# Altium schematic sheet Programming_and_Clock_FPGA.SchDoc
size A1; SheetNumber: 1; SheetTotal: 6
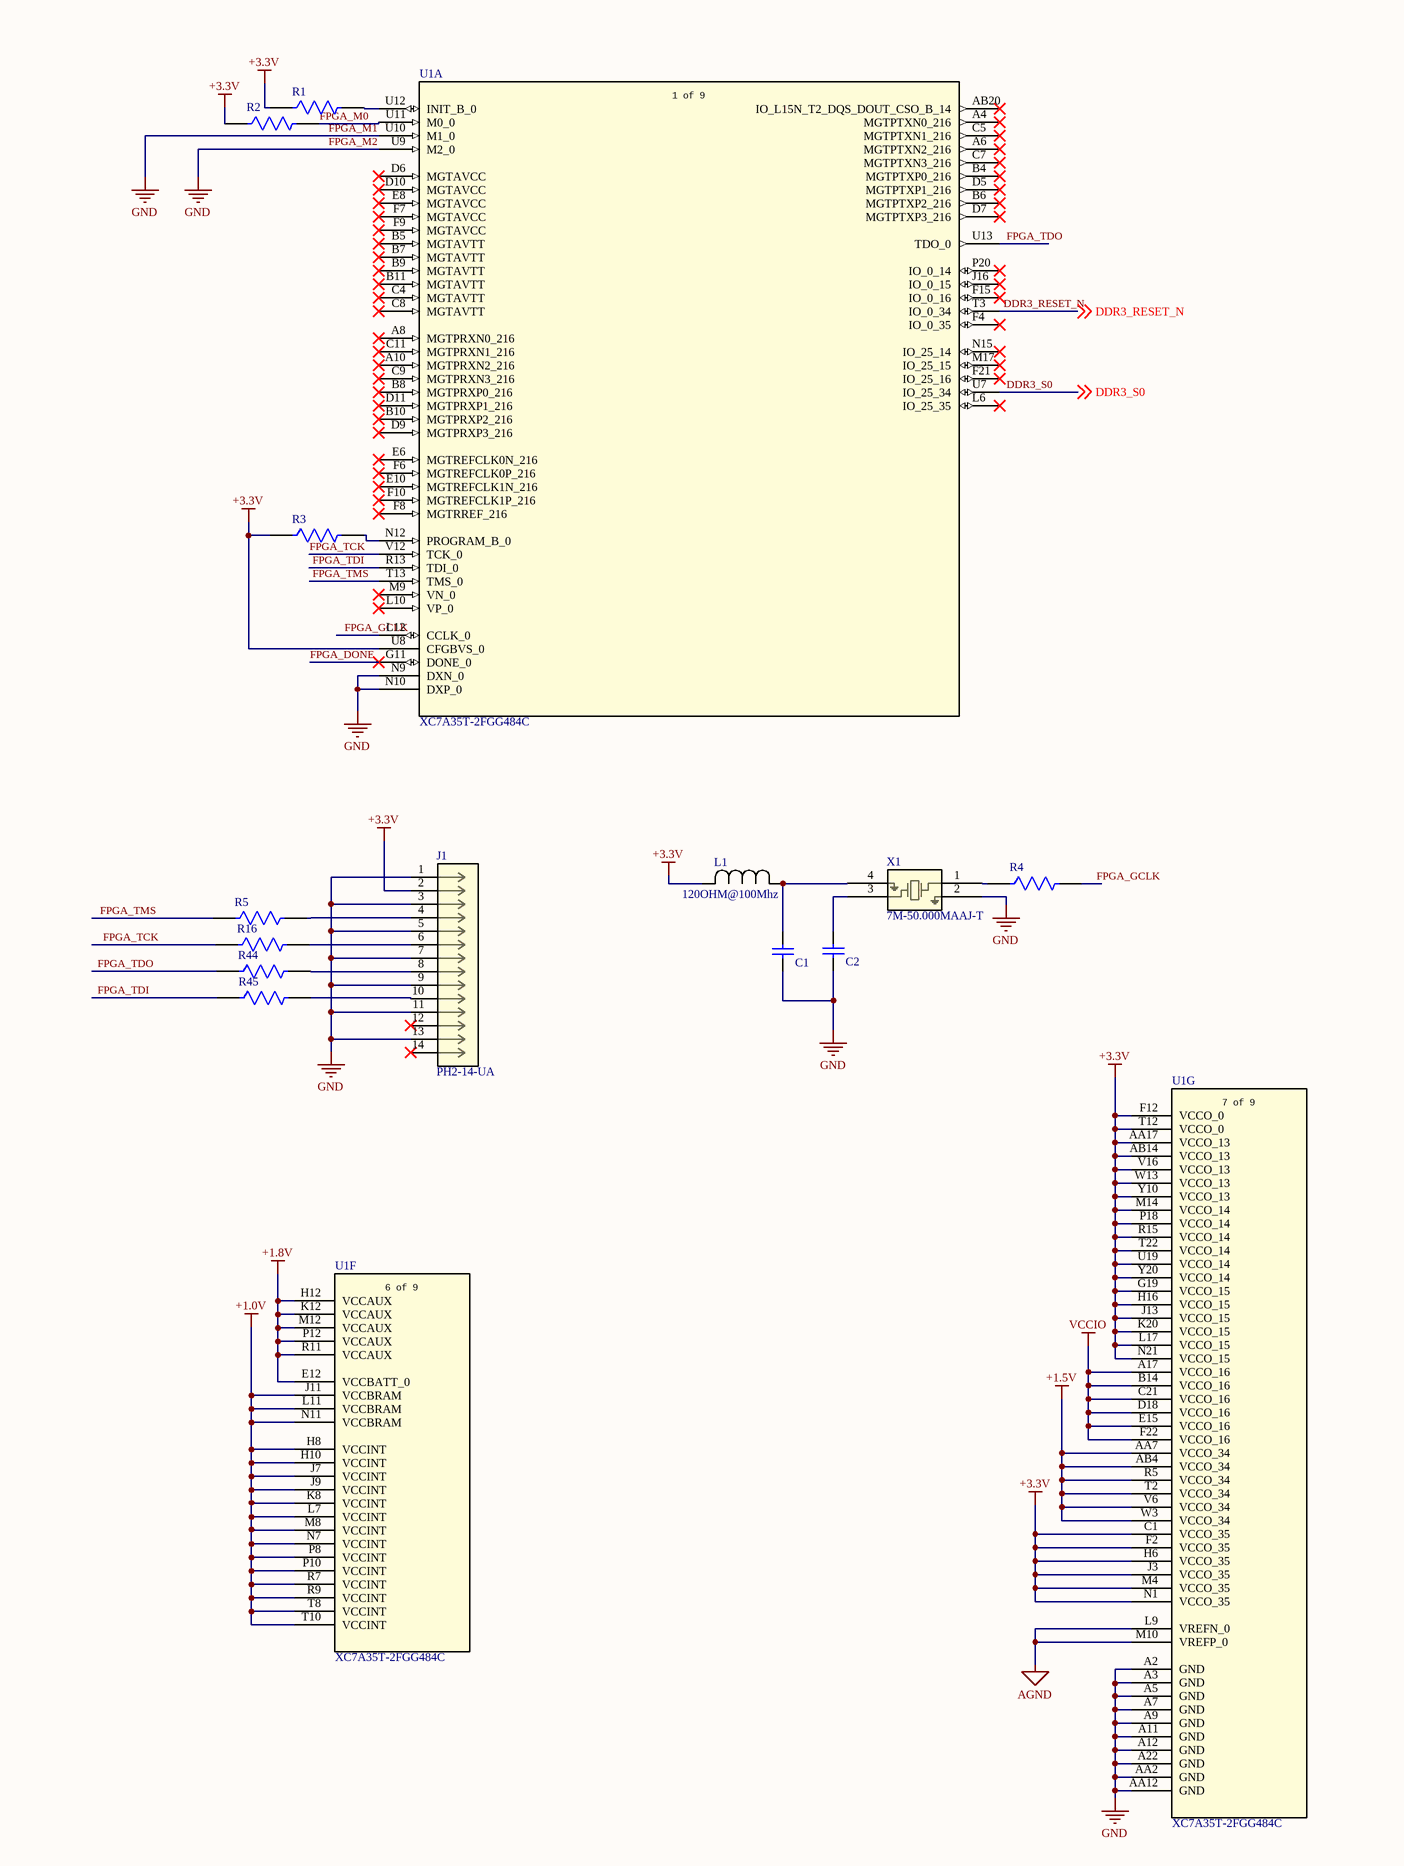
[diagram p0: Programming_and_Clock_FPGA.SchDoc, top left]
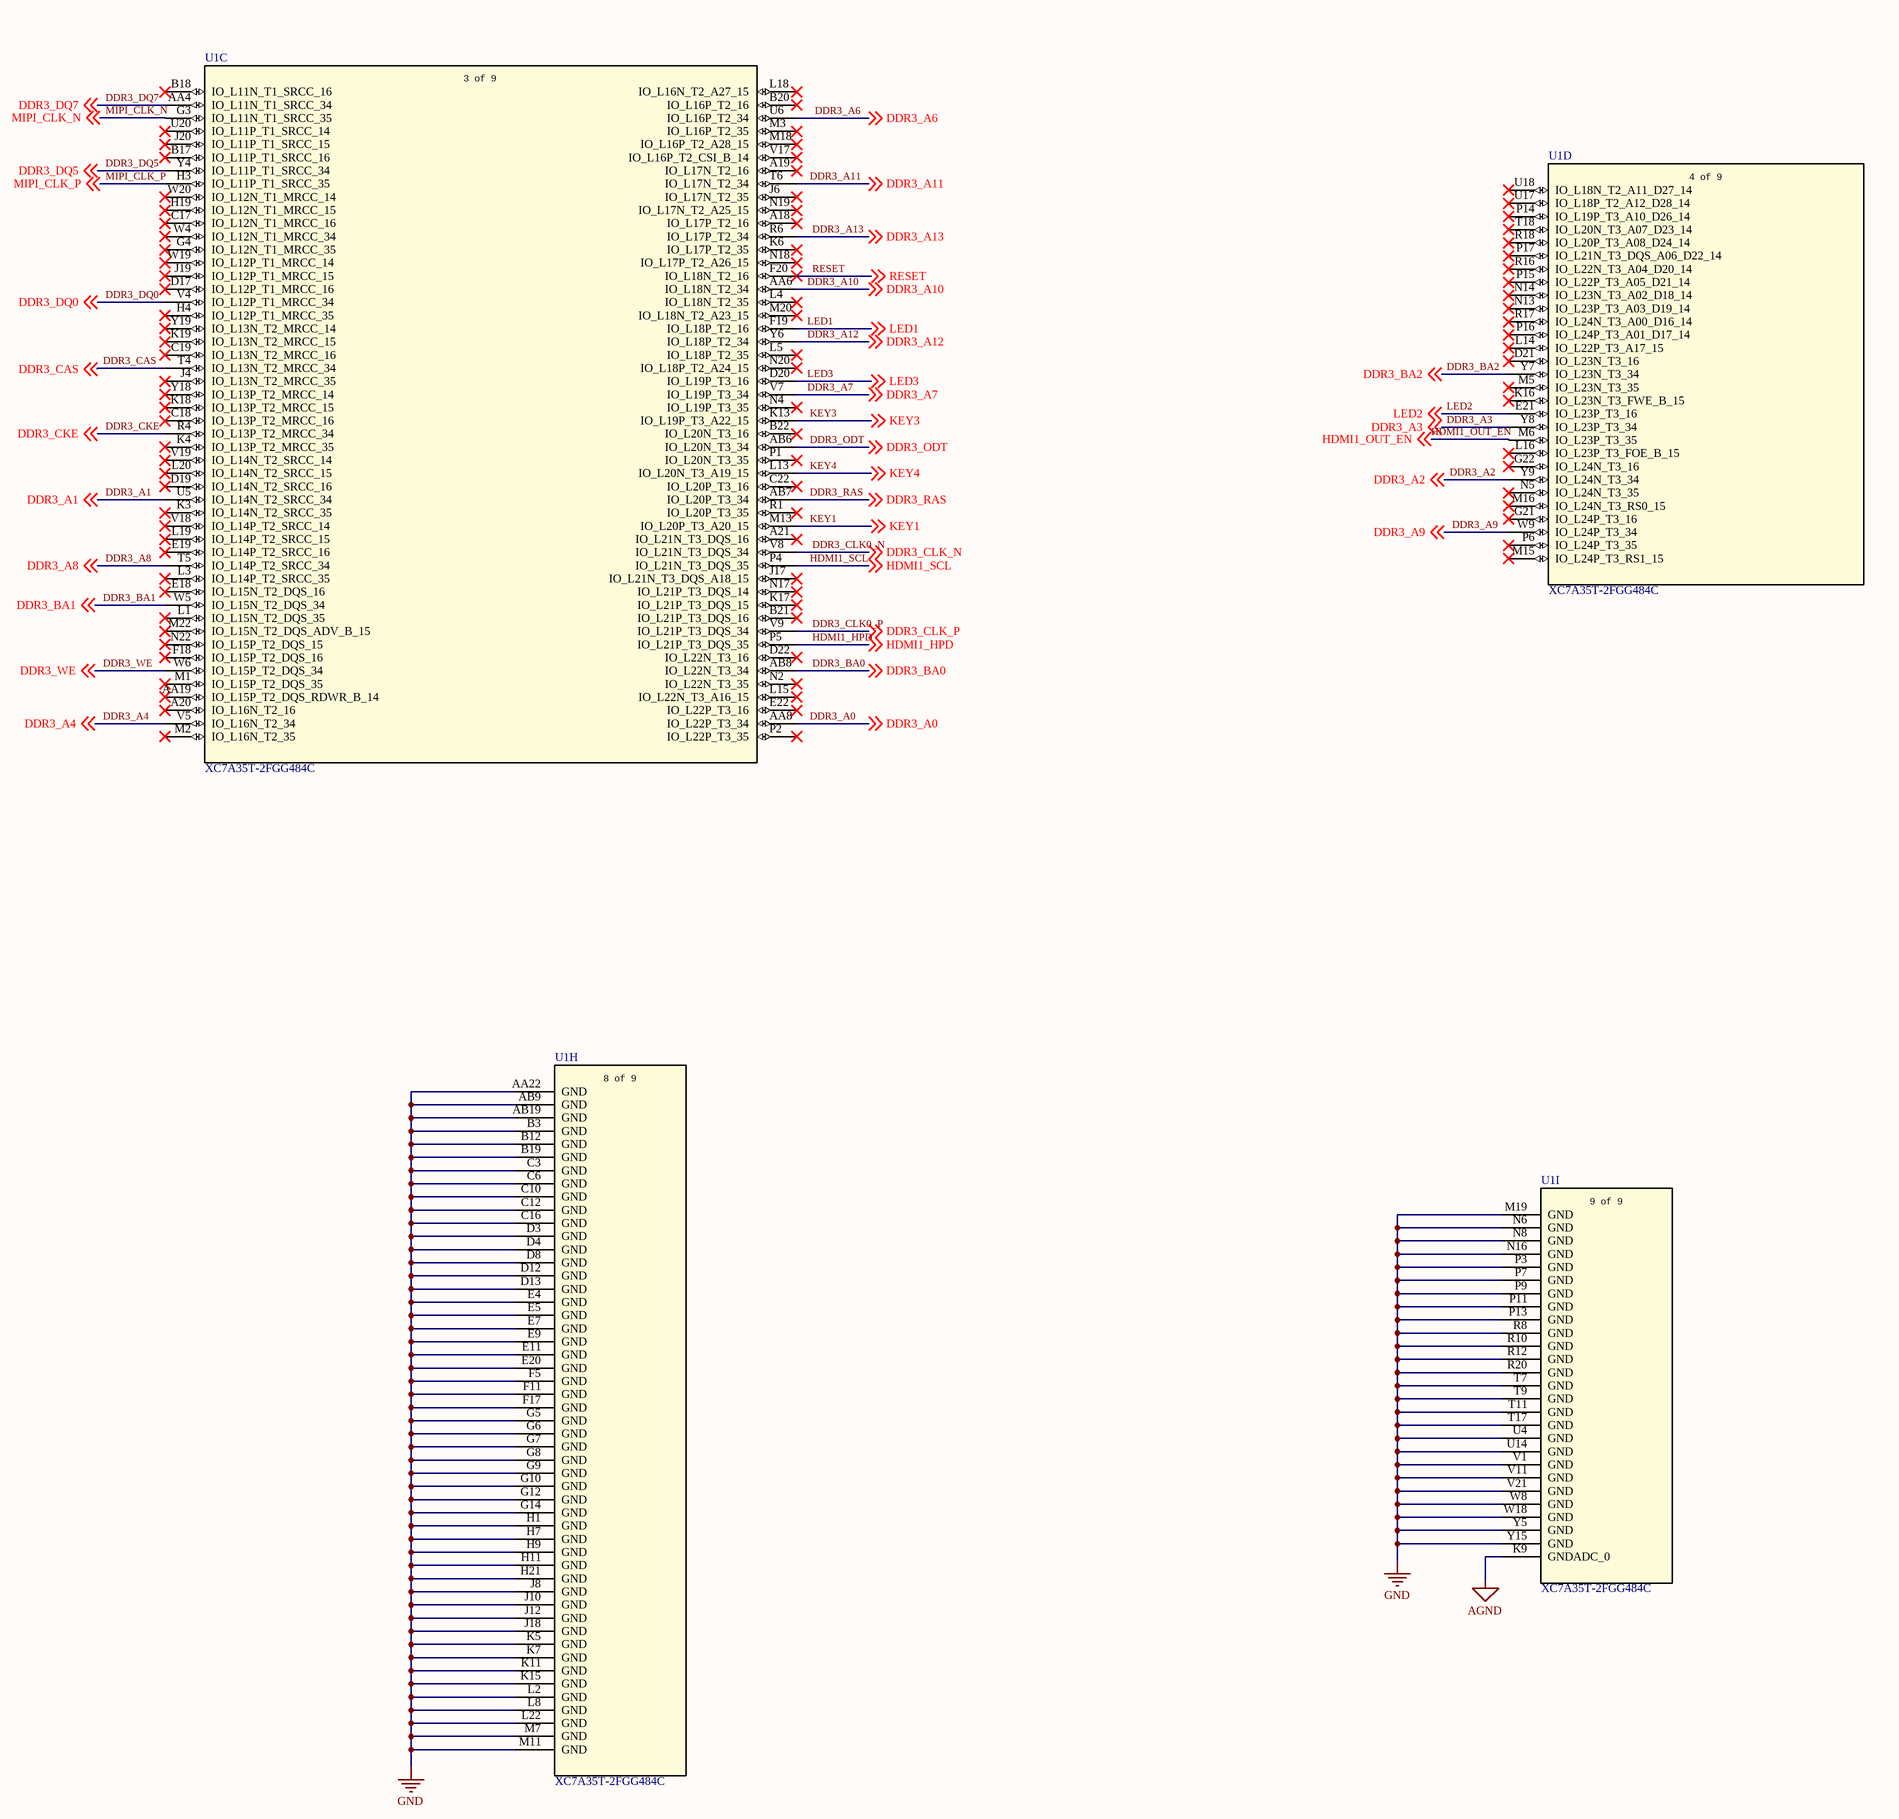
[diagram p1: Programming_and_Clock_FPGA.SchDoc, top right]
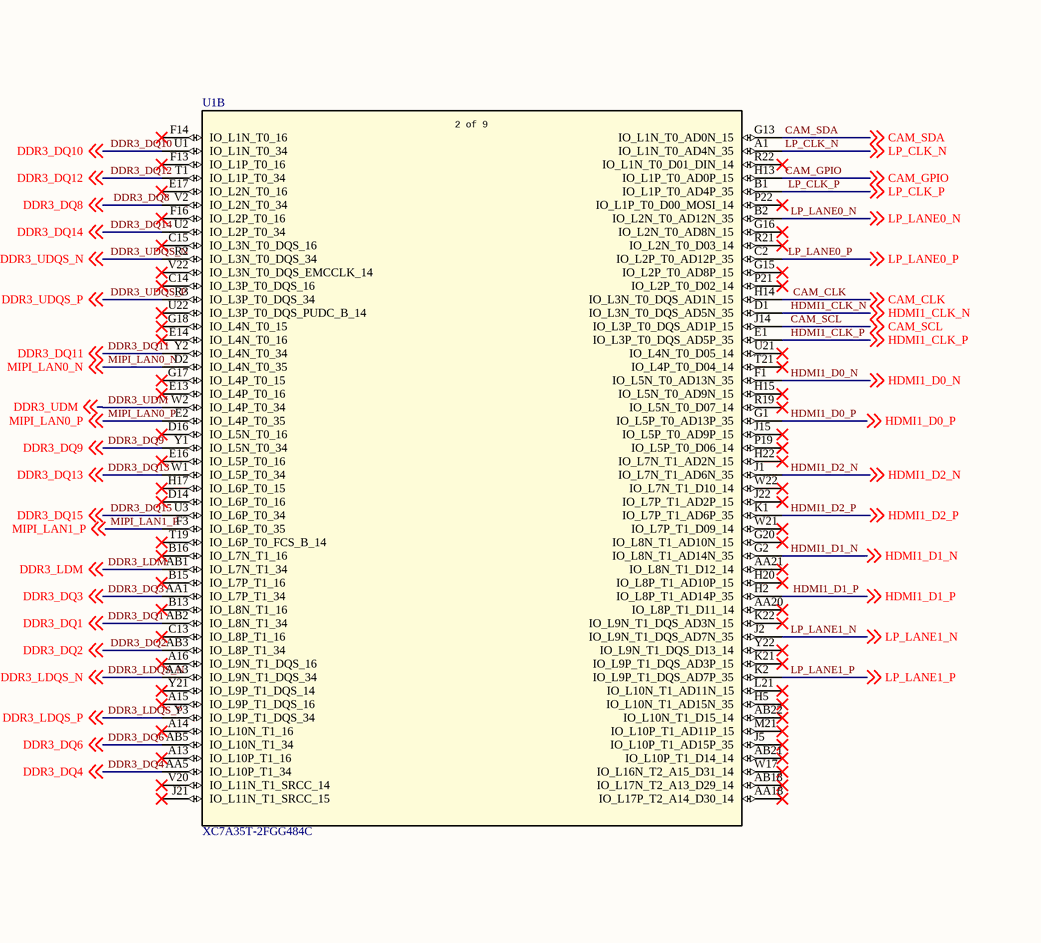
[diagram p2: Programming_and_Clock_FPGA.SchDoc, bottom left]
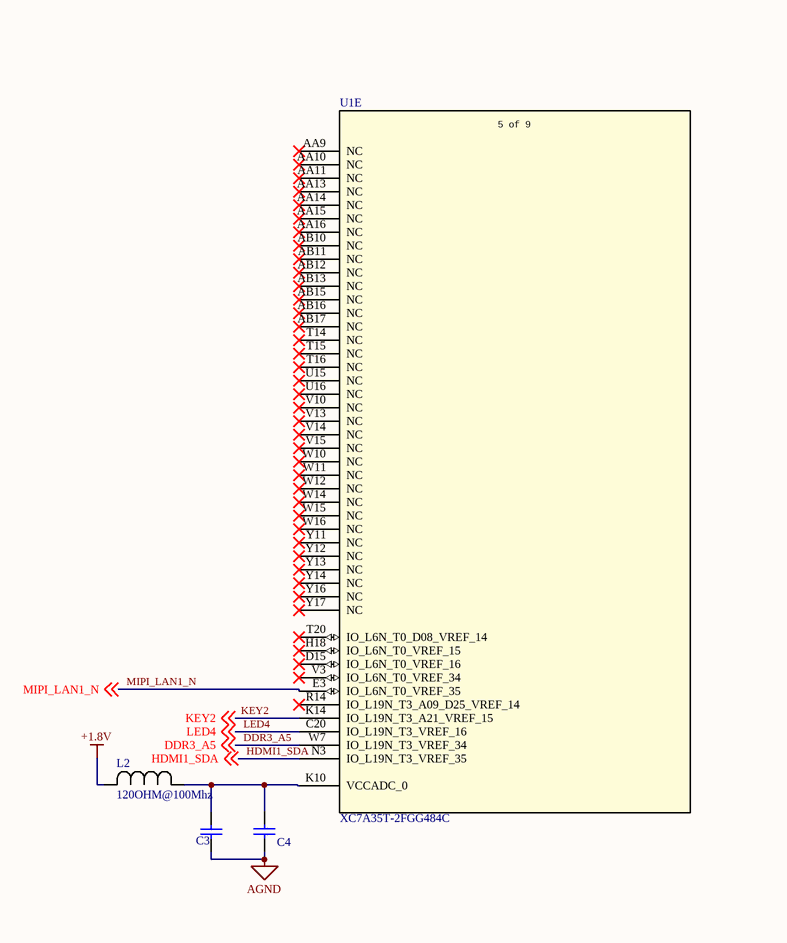
[diagram p3: Programming_and_Clock_FPGA.SchDoc, bottom right]

## Parts
C1  VJ0805Y152KXAAC  [CAPC2013X145X48NL20T23]  (value not drawn)
C2  VJ0805Y152KXAAC  [CAPC2013X145X48NL20T23]  (value not drawn)
C3  VJ0805Y152KXAAC  [CAPC2013X145X48NL20T23]  (value not drawn)
C4  VJ0805Y152KXAAC  [CAPC2013X145X48NL20T23]  (value not drawn)
J1  PH2-14-UA  [CONN_PH2-14-UA_ADM]
L1  120OHM@100Mhz  [IND_0603_TDK]
L2  120OHM@100Mhz  [IND_0603_TDK]
R1  MCU0805MD4991BP100  [FP-MCU0805-MFG]  (value not drawn)
R2  MCU0805MD4991BP100  [FP-MCU0805-MFG]  (value not drawn)
R3  MCU0805MD4991BP100  [FP-MCU0805-MFG]  (value not drawn)
R4  MCU0805MD4991BP100  [FP-MCU0805-MFG]  (value not drawn)
R5  MCU0805MD4991BP100  [FP-MCU0805-MFG]  (value not drawn)
R16  MCU0805MD4991BP100  [FP-MCU0805-MFG]  (value not drawn)
R44  MCU0805MD4991BP100  [FP-MCU0805-MFG]  (value not drawn)
R45  MCU0805MD4991BP100  [FP-MCU0805-MFG]  (value not drawn)
U1  XC7A35T-2FGG484C  [FGG484_AMD]  (parts A,B,C,D,E,F,G,H,I of 9)
X1  7M-50.000MAAJ-T  [7M_TXC]

## Nets
+1.0V: U1.H8(VCCINT) U1.H10(VCCINT) U1.J7(VCCINT) U1.J9(VCCINT) U1.J11(VCCBRAM) U1.K8(VCCINT) U1.L7(VCCINT) U1.L11(VCCBRAM) U1.M8(VCCINT) U1.N7(VCCINT) U1.N11(VCCBRAM) U1.P8(VCCINT) U1.P10(VCCINT) U1.R7(VCCINT) U1.R9(VCCINT) U1.T8(VCCINT) U1.T10(VCCINT)
+1.5V: U1.AA7(VCCO_34) U1.AB4(VCCO_34) U1.R5(VCCO_34) U1.T2(VCCO_34) U1.V6(VCCO_34) U1.W3(VCCO_34)
+1.8V: L2.2 U1.E12(VCCBATT_0) U1.H12(VCCAUX) U1.K12(VCCAUX) U1.M12(VCCAUX) U1.P12(VCCAUX) U1.R11(VCCAUX)
+3.3V: J1.2 L1.2 R1.1 R2.1 R3.1 U1.AA17(VCCO_13) U1.AB14(VCCO_13) U1.C1(VCCO_35) U1.F2(VCCO_35) U1.F12(VCCO_0) U1.H6(VCCO_35) U1.J3(VCCO_35) U1.M4(VCCO_35) U1.N1(VCCO_35) U1.T12(VCCO_0) U1.U8(CFGBVS_0) U1.V16(VCCO_13)
AGND: C3.1 C4.1 U1.K9(GNDADC_0) U1.L9(VREFN_0) U1.M10(VREFP_0)
FPGA_M1: C1.1 C2.2 J1.1 J1.3 J1.5 J1.7 J1.9 J1.11 J1.13 U1.A2(GND) U1.A3(GND) U1.A5(GND) U1.A7(GND) U1.A9(GND) U1.A11(GND) U1.A12(GND) U1.A22(GND) U1.AA2(GND) U1.AA12(GND) U1.AA22(GND) U1.AB9(GND) U1.AB19(GND) U1.B3(GND) U1.B12(GND) U1.B19(GND) U1.C3(GND) U1.C6(GND) U1.C10(GND) U1.C12(GND) U1.C16(GND) U1.D3(GND) U1.D4(GND) U1.D8(GND) U1.D12(GND) U1.D13(GND) U1.E4(GND) U1.E5(GND) U1.E7(GND) U1.E9(GND) U1.E11(GND) U1.E20(GND) U1.F5(GND) U1.F11(GND) U1.F17(GND) U1.G5(GND) U1.G6(GND) U1.G7(GND) U1.G8(GND) U1.G9(GND) U1.G10(GND) U1.G12(GND) U1.G14(GND) U1.H1(GND) U1.H7(GND) U1.H9(GND) U1.H11(GND) U1.H21(GND) U1.J8(GND) U1.J10(GND) U1.J12(GND) U1.J18(GND) U1.K5(GND) U1.K7(GND) U1.K11(GND) U1.K15(GND) U1.L2(GND) U1.L8(GND) U1.L22(GND) U1.M7(GND) U1.M11(GND) U1.M19(GND) U1.N6(GND) U1.N8(GND) U1.N9(DXN_0) U1.N10(DXP_0) U1.N16(GND) U1.P3(GND) U1.P7(GND) U1.P9(GND) U1.P11(GND) U1.P13(GND) U1.R8(GND) U1.R10(GND) U1.R12(GND) U1.R20(GND) U1.T7(GND) U1.T9(GND) U1.T11(GND) U1.T17(GND) U1.U4(GND) U1.U9(M2_0) U1.U10(M1_0) U1.U14(GND) U1.V1(GND) U1.V11(GND) U1.V21(GND) U1.W8(GND) U1.W18(GND) U1.Y5(GND) U1.Y15(GND) X1.2  [also labelled FPGA_M2, GND]
VCCIO: U1.A17(VCCO_16) U1.B14(VCCO_16) U1.C21(VCCO_16) U1.D18(VCCO_16) U1.E15(VCCO_16) U1.F22(VCCO_16)
CAM_CLK: U1.H14(IO_L3N_T0_DQS_AD1N_15) ; off-sheet CAM_CLK
CAM_GPIO: U1.H13(IO_L1P_T0_AD0P_15) ; off-sheet CAM_GPIO
CAM_SCL: U1.J14(IO_L3P_T0_DQS_AD1P_15) ; off-sheet CAM_SCL
CAM_SDA: U1.G13(IO_L1N_T0_AD0N_15) ; off-sheet CAM_SDA
DDR3_A0: U1.AA8(IO_L22P_T3_34) ; off-sheet DDR3_A0
DDR3_A1: U1.U5(IO_L14N_T2_SRCC_34) ; off-sheet DDR3_A1
DDR3_A2: U1.Y9(IO_L24N_T3_34) ; off-sheet DDR3_A2
DDR3_A3: U1.Y8(IO_L23P_T3_34) ; off-sheet DDR3_A3
DDR3_A4: U1.V5(IO_L16N_T2_34) ; off-sheet DDR3_A4
DDR3_A5: U1.W7(IO_L19N_T3_VREF_34) ; off-sheet DDR3_A5
DDR3_A6: U1.U6(IO_L16P_T2_34) ; off-sheet DDR3_A6
DDR3_A7: U1.V7(IO_L19P_T3_34) ; off-sheet DDR3_A7
DDR3_A8: U1.T5(IO_L14P_T2_SRCC_34) ; off-sheet DDR3_A8
DDR3_A9: U1.W9(IO_L24P_T3_34) ; off-sheet DDR3_A9
DDR3_A10: U1.AA6(IO_L18N_T2_34) ; off-sheet DDR3_A10
DDR3_A11: U1.T6(IO_L17N_T2_34) ; off-sheet DDR3_A11
DDR3_A12: U1.Y6(IO_L18P_T2_34) ; off-sheet DDR3_A12
DDR3_A13: U1.R6(IO_L17P_T2_34) ; off-sheet DDR3_A13
DDR3_BA0: U1.AB8(IO_L22N_T3_34) ; off-sheet DDR3_BA0
DDR3_BA1: U1.W5(IO_L15N_T2_DQS_34) ; off-sheet DDR3_BA1
DDR3_BA2: U1.Y7(IO_L23N_T3_34) ; off-sheet DDR3_BA2
DDR3_CAS: U1.T4(IO_L13N_T2_MRCC_34) ; off-sheet DDR3_CAS
DDR3_CKE: U1.R4(IO_L13P_T2_MRCC_34) ; off-sheet DDR3_CKE
DDR3_CLK0_N: U1.V8(IO_L21N_T3_DQS_34) ; off-sheet DDR3_CLK_N  [also labelled DDR3_CLK_N]
DDR3_CLK0_P: U1.V9(IO_L21P_T3_DQS_34) ; off-sheet DDR3_CLK_P  [also labelled DDR3_CLK_P]
DDR3_DQ0: U1.V4(IO_L12P_T1_MRCC_34) ; off-sheet DDR3_DQ0
DDR3_DQ1: U1.AB2(IO_L8N_T1_34) ; off-sheet DDR3_DQ1
DDR3_DQ2: U1.AB3(IO_L8P_T1_34) ; off-sheet DDR3_DQ2
DDR3_DQ3: U1.AA1(IO_L7P_T1_34) ; off-sheet DDR3_DQ3
DDR3_DQ4: U1.AA5(IO_L10P_T1_34) ; off-sheet DDR3_DQ4
DDR3_DQ5: U1.Y4(IO_L11P_T1_SRCC_34) ; off-sheet DDR3_DQ5
DDR3_DQ6: U1.AB5(IO_L10N_T1_34) ; off-sheet DDR3_DQ6
DDR3_DQ7: U1.AA4(IO_L11N_T1_SRCC_34) ; off-sheet DDR3_DQ7
DDR3_DQ8: U1.V2(IO_L2N_T0_34) ; off-sheet DDR3_DQ8
DDR3_DQ9: U1.Y1(IO_L5N_T0_34) ; off-sheet DDR3_DQ9
DDR3_DQ10: U1.U1(IO_L1N_T0_34) ; off-sheet DDR3_DQ10
DDR3_DQ11: U1.Y2(IO_L4N_T0_34) ; off-sheet DDR3_DQ11
DDR3_DQ12: U1.T1(IO_L1P_T0_34) ; off-sheet DDR3_DQ12
DDR3_DQ13: U1.W1(IO_L5P_T0_34) ; off-sheet DDR3_DQ13
DDR3_DQ14: U1.U2(IO_L2P_T0_34) ; off-sheet DDR3_DQ14
DDR3_DQ15: U1.U3(IO_L6P_T0_34) ; off-sheet DDR3_DQ15
DDR3_LDM: U1.AB1(IO_L7N_T1_34) ; off-sheet DDR3_LDM
DDR3_LDQS_N: U1.AA3(IO_L9N_T1_DQS_34) ; off-sheet DDR3_LDQS_N
DDR3_LDQS_P: U1.Y3(IO_L9P_T1_DQS_34) ; off-sheet DDR3_LDQS_P
DDR3_ODT: U1.AB6(IO_L20N_T3_34) ; off-sheet DDR3_ODT
DDR3_RAS: U1.AB7(IO_L20P_T3_34) ; off-sheet DDR3_RAS
DDR3_RESET_N: U1.T3(IO_0_34) ; off-sheet DDR3_RESET_N
DDR3_S0: U1.U7(IO_25_34) ; off-sheet DDR3_S0
DDR3_UDM: U1.W2(IO_L4P_T0_34) ; off-sheet DDR3_UDM
DDR3_UDQS_N: U1.R2(IO_L3N_T0_DQS_34) ; off-sheet DDR3_UDQS_N
DDR3_UDQS_P: U1.R3(IO_L3P_T0_DQS_34) ; off-sheet DDR3_UDQS_P
DDR3_WE: U1.W6(IO_L15P_T2_DQS_34) ; off-sheet DDR3_WE
FPGA_DONE: U1.G11(DONE_0)
FPGA_GCLK: R4.2 U1.L12(CCLK_0)
FPGA_M0: R2.2 U1.U11(M0_0)
FPGA_TCK: R16.1 U1.V12(TCK_0)
FPGA_TDI: R45.1 U1.R13(TDI_0)
FPGA_TDO: R44.1 U1.U13(TDO_0)
FPGA_TMS: R5.1 U1.T13(TMS_0)
HDMI1_CLK_N: U1.D1(IO_L3N_T0_DQS_AD5N_35) ; off-sheet HDMI1_CLK_N
HDMI1_CLK_P: U1.E1(IO_L3P_T0_DQS_AD5P_35) ; off-sheet HDMI1_CLK_P
HDMI1_D0_N: U1.F1(IO_L5N_T0_AD13N_35) ; off-sheet HDMI1_D0_N
HDMI1_D0_P: U1.G1(IO_L5P_T0_AD13P_35) ; off-sheet HDMI1_D0_P
HDMI1_D1_N: U1.G2(IO_L8N_T1_AD14N_35) ; off-sheet HDMI1_D1_N
HDMI1_D1_P: U1.H2(IO_L8P_T1_AD14P_35) ; off-sheet HDMI1_D1_P
HDMI1_D2_N: U1.J1(IO_L7N_T1_AD6N_35) ; off-sheet HDMI1_D2_N
HDMI1_D2_P: U1.K1(IO_L7P_T1_AD6P_35) ; off-sheet HDMI1_D2_P
HDMI1_HPD: U1.P5(IO_L21P_T3_DQS_35) ; off-sheet HDMI1_HPD
HDMI1_OUT_EN: U1.M6(IO_L23P_T3_35) ; off-sheet HDMI1_OUT_EN
HDMI1_SCL: U1.P4(IO_L21N_T3_DQS_35) ; off-sheet HDMI1_SCL
HDMI1_SDA: U1.N3(IO_L19N_T3_VREF_35) ; off-sheet HDMI1_SDA
KEY1: U1.M13(IO_L20P_T3_A20_15) ; off-sheet KEY1
KEY2: U1.K14(IO_L19N_T3_A21_VREF_15) ; off-sheet KEY2
KEY3: U1.K13(IO_L19P_T3_A22_15) ; off-sheet KEY3
KEY4: U1.L13(IO_L20N_T3_A19_15) ; off-sheet KEY4
LED1: U1.F19(IO_L18P_T2_16) ; off-sheet LED1
LED2: U1.E21(IO_L23P_T3_16) ; off-sheet LED2
LED3: U1.D20(IO_L19P_T3_16) ; off-sheet LED3
LED4: U1.C20(IO_L19N_T3_VREF_16) ; off-sheet LED4
LP_CLK_N: U1.A1(IO_L1N_T0_AD4N_35) ; off-sheet LP_CLK_N
LP_CLK_P: U1.B1(IO_L1P_T0_AD4P_35) ; off-sheet LP_CLK_P
LP_LANE0_N: U1.B2(IO_L2N_T0_AD12N_35) ; off-sheet LP_LANE0_N
LP_LANE0_P: U1.C2(IO_L2P_T0_AD12P_35) ; off-sheet LP_LANE0_P
LP_LANE1_N: U1.J2(IO_L9N_T1_DQS_AD7N_35) ; off-sheet LP_LANE1_N
LP_LANE1_P: U1.K2(IO_L9P_T1_DQS_AD7P_35) ; off-sheet LP_LANE1_P
MIPI_CLK_N: U1.G3(IO_L11N_T1_SRCC_35) ; off-sheet MIPI_CLK_N
MIPI_CLK_P: U1.H3(IO_L11P_T1_SRCC_35) ; off-sheet MIPI_CLK_P
MIPI_LAN0_N: U1.D2(IO_L4N_T0_35) ; off-sheet MIPI_LAN0_N
MIPI_LAN0_P: U1.E2(IO_L4P_T0_35) ; off-sheet MIPI_LAN0_P
MIPI_LAN1_N: U1.E3(IO_L6N_T0_VREF_35) ; off-sheet MIPI_LAN1_N
MIPI_LAN1_P: U1.F3(IO_L6P_T0_35) ; off-sheet MIPI_LAN1_P
RESET: U1.F20(IO_L18N_T2_16) ; off-sheet RESET
NetC1_2: C1.2 L1.1 X1.4
NetC2_1: C2.1 X1.3
NetC3_2: C3.2 C4.2 L2.1 U1.K10(VCCADC_0)
NetJ1_4: J1.4 R5.2
NetJ1_6: J1.6 R16.2
NetJ1_8: J1.8 R44.2
NetJ1_10: J1.10 R45.2
NetR1_2: R1.2 U1.U12(INIT_B_0)
NetR3_2: R3.2 U1.N12(PROGRAM_B_0)
NetR4_1: R4.1 X1.1
NetU1_G19: U1.G19(VCCO_15) U1.H16(VCCO_15) U1.J13(VCCO_15) U1.K20(VCCO_15) U1.L17(VCCO_15) U1.M14(VCCO_14) U1.N21(VCCO_15) U1.P18(VCCO_14) U1.R15(VCCO_14) U1.T22(VCCO_14) U1.U19(VCCO_14) U1.W13(VCCO_13) U1.Y10(VCCO_13) U1.Y20(VCCO_14)

Not connected (* = marked no-connect by the designer): J1 12* 14*; U1 A4(MGTPTXN0_216)* A6(MGTPTXN2_216)* A8(MGTPRXN0_216)* A10(MGTPRXN2_216)* A13(IO_L10P_T1_16)* A14(IO_L10N_T1_16)* A15(IO_L9P_T1_DQS_16)* A16(IO_L9N_T1_DQS_16)* A18(IO_L17P_T2_16)* A19(IO_L17N_T2_16)* A20(IO_L16N_T2_16)* A21(IO_L21N_T3_DQS_16)* AA9(NC)* AA10(NC)* AA11(NC)* AA13(NC)* AA14(NC)* AA15(NC)* AA16(NC)* AA18(IO_L17P_T2_A14_D30_14)* AA19(IO_L15P_T2_DQS_RDWR_B_14)* AA20(IO_L8P_T1_D11_14)* AA21(IO_L8N_T1_D12_14)* AB10(NC)* AB11(NC)* AB12(NC)* AB13(NC)* AB15(NC)* AB16(NC)* AB17(NC)* AB18(IO_L17N_T2_A13_D29_14)* AB20(IO_L15N_T2_DQS_DOUT_CSO_B_14)* AB21(IO_L10P_T1_D14_14)* AB22(IO_L10N_T1_D15_14)* B4(MGTPTXP0_216)* B5(MGTAVTT)* B6(MGTPTXP2_216)* B7(MGTAVTT)* B8(MGTPRXP0_216)* B9(MGTAVTT)* B10(MGTPRXP2_216)* B11(MGTAVTT)* B13(IO_L8N_T1_16)* B15(IO_L7P_T1_16)* B16(IO_L7N_T1_16)* B17(IO_L11P_T1_SRCC_16)* B18(IO_L11N_T1_SRCC_16)* B20(IO_L16P_T2_16)* B21(IO_L21P_T3_DQS_16)* B22(IO_L20N_T3_16)* C4(MGTAVTT)* C5(MGTPTXN1_216)* C7(MGTPTXN3_216)* C8(MGTAVTT)* C9(MGTPRXN3_216)* C11(MGTPRXN1_216)* C13(IO_L8P_T1_16)* C14(IO_L3P_T0_DQS_16)* C15(IO_L3N_T0_DQS_16)* C17(IO_L12N_T1_MRCC_16)* C18(IO_L13P_T2_MRCC_16)* C19(IO_L13N_T2_MRCC_16)* C22(IO_L20P_T3_16)* D5(MGTPTXP1_216)* D6(MGTAVCC)* D7(MGTPTXP3_216)* D9(MGTPRXP3_216)* D10(MGTAVCC)* D11(MGTPRXP1_216)* D14(IO_L6P_T0_16)* D15(IO_L6N_T0_VREF_16)* D16(IO_L5N_T0_16)* D17(IO_L12P_T1_MRCC_16)* D19(IO_L14N_T2_SRCC_16)* D21(IO_L23N_T3_16)* D22(IO_L22N_T3_16)* E6(MGTREFCLK0N_216)* E8(MGTAVCC)* E10(MGTREFCLK1N_216)* E13(IO_L4P_T0_16)* E14(IO_L4N_T0_16)* E16(IO_L5P_T0_16)* E17(IO_L2N_T0_16)* E18(IO_L15N_T2_DQS_16)* E19(IO_L14P_T2_SRCC_16)* E22(IO_L22P_T3_16)* F4(IO_0_35)* F6(MGTREFCLK0P_216)* F7(MGTAVCC)* F8(MGTRREF_216)* F9(MGTAVCC)* F10(MGTREFCLK1P_216)* F13(IO_L1P_T0_16)* F14(IO_L1N_T0_16)* F15(IO_0_16)* F16(IO_L2P_T0_16)* F18(IO_L15P_T2_DQS_16)* F21(IO_25_16)* G4(IO_L12N_T1_MRCC_35)* G15(IO_L2P_T0_AD8P_15)* G16(IO_L2N_T0_AD8N_15)* G17(IO_L4P_T0_15)* G18(IO_L4N_T0_15)* G20(IO_L8N_T1_AD10N_15)* G21(IO_L24P_T3_16)* G22(IO_L24N_T3_16)* H4(IO_L12P_T1_MRCC_35)* H5(IO_L10N_T1_AD15N_35)* H15(IO_L5N_T0_AD9N_15)* H17(IO_L6P_T0_15)* H18(IO_L6N_T0_VREF_15)* H19(IO_L12N_T1_MRCC_15)* H20(IO_L8P_T1_AD10P_15)* H22(IO_L7N_T1_AD2N_15)* J4(IO_L13N_T2_MRCC_35)* J5(IO_L10P_T1_AD15P_35)* J6(IO_L17N_T2_35)* J15(IO_L5P_T0_AD9P_15)* J16(IO_0_15)* J17(IO_L21N_T3_DQS_A18_15)* J19(IO_L12P_T1_MRCC_15)* J20(IO_L11P_T1_SRCC_15)* J21(IO_L11N_T1_SRCC_15)* J22(IO_L7P_T1_AD2P_15)* K3(IO_L14N_T2_SRCC_35)* K4(IO_L13P_T2_MRCC_35)* K6(IO_L17P_T2_35)* K16(IO_L23N_T3_FWE_B_15)* K17(IO_L21P_T3_DQS_15)* K18(IO_L13P_T2_MRCC_15)* K19(IO_L13N_T2_MRCC_15)* K21(IO_L9P_T1_DQS_AD3P_15)* K22(IO_L9N_T1_DQS_AD3N_15)* L1(IO_L15N_T2_DQS_35)* L3(IO_L14P_T2_SRCC_35)* L4(IO_L18N_T2_35)* L5(IO_L18P_T2_35)* L6(IO_25_35)* L10(VP_0)* L14(IO_L22P_T3_A17_15)* L15(IO_L22N_T3_A16_15)* L16(IO_L23P_T3_FOE_B_15)* L18(IO_L16N_T2_A27_15)* L19(IO_L14P_T2_SRCC_15)* L20(IO_L14N_T2_SRCC_15)* L21(IO_L10N_T1_AD11N_15)* M1(IO_L15P_T2_DQS_35)* M2(IO_L16N_T2_35)* M3(IO_L16P_T2_35)* M5(IO_L23N_T3_35)* M9(VN_0)* M15(IO_L24P_T3_RS1_15)* M16(IO_L24N_T3_RS0_15)* M17(IO_25_15)* M18(IO_L16P_T2_A28_15)* M20(IO_L18N_T2_A23_15)* M21(IO_L10P_T1_AD11P_15)* M22(IO_L15N_T2_DQS_ADV_B_15)* N2(IO_L22N_T3_35)* N4(IO_L19P_T3_35)* N5(IO_L24N_T3_35)* N13(IO_L23P_T3_A03_D19_14)* N14(IO_L23N_T3_A02_D18_14)* N15(IO_25_14)* N17(IO_L21P_T3_DQS_14)* N18(IO_L17P_T2_A26_15)* N19(IO_L17N_T2_A25_15)* N20(IO_L18P_T2_A24_15)* N22(IO_L15P_T2_DQS_15)* P1(IO_L20N_T3_35)* P2(IO_L22P_T3_35)* P6(IO_L24P_T3_35)* P14(IO_L19P_T3_A10_D26_14)* P15(IO_L22P_T3_A05_D21_14)* P16(IO_L24P_T3_A01_D17_14)* P17(IO_L21N_T3_DQS_A06_D22_14)* P19(IO_L5P_T0_D06_14)* P20(IO_0_14)* P21(IO_L2P_T0_D02_14)* P22(IO_L1P_T0_D00_MOSI_14)* R1(IO_L20P_T3_35)* R14(IO_L19N_T3_A09_D25_VREF_14)* R16(IO_L22N_T3_A04_D20_14)* R17(IO_L24N_T3_A00_D16_14)* R18(IO_L20P_T3_A08_D24_14)* R19(IO_L5N_T0_D07_14)* R21(IO_L2N_T0_D03_14)* R22(IO_L1N_T0_D01_DIN_14)* T14(NC)* T15(NC)* T16(NC)* T18(IO_L20N_T3_A07_D23_14)* T19(IO_L6P_T0_FCS_B_14)* T20(IO_L6N_T0_D08_VREF_14)* T21(IO_L4P_T0_D04_14)* U15(NC)* U16(NC)* U17(IO_L18P_T2_A12_D28_14)* U18(IO_L18N_T2_A11_D27_14)* U20(IO_L11P_T1_SRCC_14)* U21(IO_L4N_T0_D05_14)* U22(IO_L3P_T0_DQS_PUDC_B_14)* V3(IO_L6N_T0_VREF_34)* V10(NC)* V13(NC)* V14(NC)* V15(NC)* V17(IO_L16P_T2_CSI_B_14)* V18(IO_L14P_T2_SRCC_14)* V19(IO_L14N_T2_SRCC_14)* V20(IO_L11N_T1_SRCC_14)* V22(IO_L3N_T0_DQS_EMCCLK_14)* W4(IO_L12N_T1_MRCC_34)* W10(NC)* W11(NC)* W12(NC)* W14(NC)* W15(NC)* W16(NC)* W17(IO_L16N_T2_A15_D31_14)* W19(IO_L12P_T1_MRCC_14)* W20(IO_L12N_T1_MRCC_14)* W21(IO_L7P_T1_D09_14)* W22(IO_L7N_T1_D10_14)* Y11(NC)* Y12(NC)* Y13(NC)* Y14(NC)* Y16(NC)* Y17(NC)* Y18(IO_L13P_T2_MRCC_14)* Y19(IO_L13N_T2_MRCC_14)* Y21(IO_L9P_T1_DQS_14)* Y22(IO_L9N_T1_DQS_D13_14)*

## Notes on the sheet
- (in symbol XC7A35T-2FGG484C, part A) 1 of 9
- (in symbol XC7A35T-2FGG484C, part B) 2 of 9
- (in symbol XC7A35T-2FGG484C, part C) 3 of 9
- (in symbol XC7A35T-2FGG484C, part D) 4 of 9
- (in symbol XC7A35T-2FGG484C, part E) 5 of 9
- (in symbol XC7A35T-2FGG484C, part F) 6 of 9
- (in symbol XC7A35T-2FGG484C, part G) 7 of 9
- (in symbol XC7A35T-2FGG484C, part H) 8 of 9
- (in symbol XC7A35T-2FGG484C, part I) 9 of 9

## Library data of the parts
C1-C4 = CMP-2007-01729-1: Manufacturer: Vitramon; Part Number: VJ0805Y152KXAAC
J1 = PH2-14-UA: Description; Manufacturer_Name: ADAM TECHNOLOGIES INC; Type: Headers, Male Pins; Copyright: Copyright (C) 2025 Ultra Librarian. All rights reserved.; Manufacturer_Part_Number: PH2-14-UA; RefDes: RefDes
L1 L2 = MMZ0603Y121CT000: Description; Manufacturer_Name: TDK; Copyright: Copyright (C) 2026 Ultra Librarian. All rights reserved.; Manufacturer_Part_Number: MMZ0603Y121CT000
R1-R5 R16 R44 R45 = CMP-02407-000217-1: RES 1.05K OHM 0.5% 1/5W 0805; Resistance: 4.99kR; Power Rating: 200mW; Tolerance: 0.1%; Voltage Rating: 150V; Weight: 0.000194oz; Package Quantity: 1000; Height: 0.52mm; Case Code (Imperial): 0805; Width: 1.25mm; Packaging: Tape and Reel; Case/Package: 0805; Length: 2mm; Composition: Thin Film; Termination: SMD/SMT; Min Operating Temperature: -55°C; Case Code (Metric): 2012; Max Operating Temperature: 155°C
U1 = XC7A35T-2FGG484C: Description; Manufacturer_Name: AMD; Copyright: Copyright (C) 2026 Ultra Librarian. All rights reserved.; Manufacturer_Part_Number: XC7A35T-2FGG484C; RefDes: RefDes; Type: Type
X1 = 7M-50.000MAAJ-T: No Description Available; Manufacturer_Name: TXC; Copyright: Copyright (C) 2026 Ultra Librarian. All rights reserved.; Manufacturer_Part_Number: 7M-50.000MAAJ-T; RefDes: RefDes; Type: Type